# Altium schematic sheet PWMSoldeerbout.SchDoc
size A4; SheetNumber: 5; SheetTotal: 5
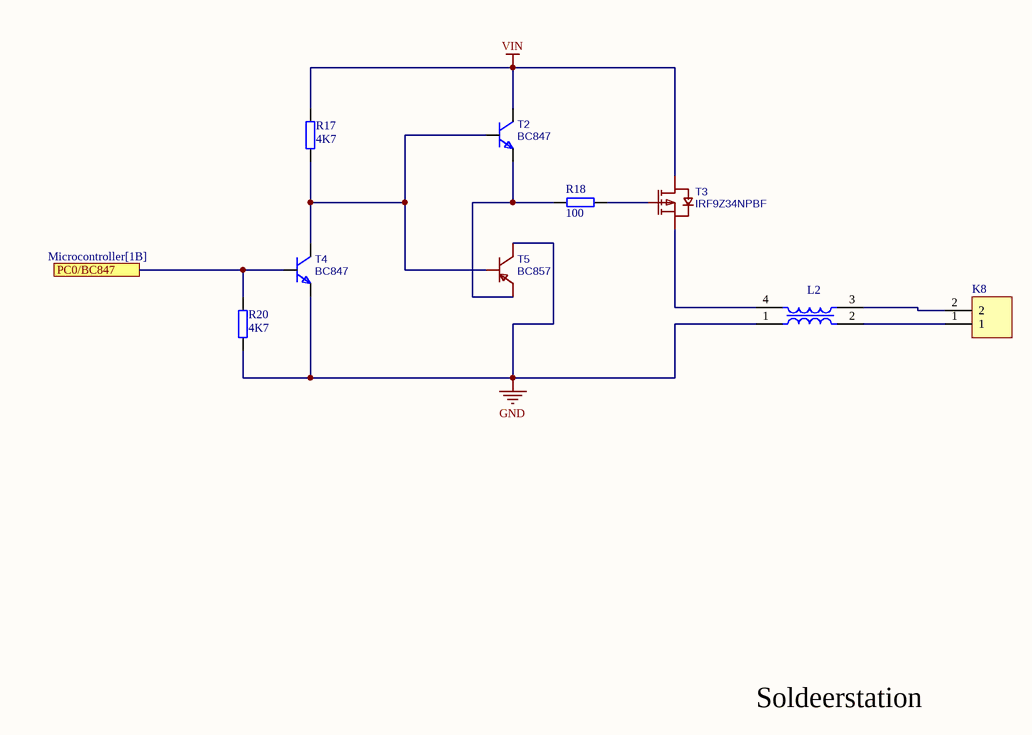
[diagram p0: PWMSoldeerbout.SchDoc]

## Parts
K8  (no value)  [Terminal_2]
L2  (no value)  [L1 Smoorspoel]
R17  4K7  [RESC2013X50X30ML20T20]
R18  100  [RESC2013X50X30ML20T20]
R20  4K7  [RESC2013X50X30ML20T20]
T2  BC847  [T1,2,4 Bipolar Transistors]
T3  IRF9Z34NPBF  [T3 MOSFET-P]
T4  BC847  [T1,2,4 Bipolar Transistors]
T5  BC857  [T5 Bipolar Transistors]

## Ports
PC0/BC847 (see Microcontroller[1B])

## Nets
GND: L2.1 R20.1 T4.2(E) T5.3
VIN: R17.2 T2.3(C) T3.2(D)
PC0/BC847: R20.2 T4.1(B) ; port PC0/BC847
NetK8_1: K8.1 L2.2
NetK8_2: K8.2 L2.3
NetL2_4: L2.4 T3.3(S)
NetR17_1: R17.1 T2.1(B) T4.3(C) T5.1
NetR18_1: R18.1 T3.1(G)
NetR18_2: R18.2 T2.2(E) T5.2

## Notes on the sheet
- Soldeerstation

## Library data of the parts
K8 = K Terminal_2
L2 = L2 Common Mode Choke: Common Mode Chokes / Filters 170ohms 100MHz 10A 1 Choke SMD; Manufacturer_Name: Laird Performance Materials; Manufacturer_Part_Number: CM2545X171R-10; Geometry.Height: 9.5mm; Mouser Part Number: 875-CM2545X171R-10; Mouser Price/Stock: https://www.mouser.co.uk/ProductDetail/Laird-Performance-Materials/CM2545X171R-10?qs=gHrF1kHvtHWa9UjYzLX7bQ%3D%3D; Datasheet Link: https://componentsearchengine.com/Datasheets/1/CM2545X171R-10.pdf
R17 R18 R20 = R Resistor: Manufacturer: Vishay Dale; Part Number: CRCW08050000Z0EA
T2 T4 = T1,2,4 transisitors: BC847C_C3027113; BOM_Manufacturer: SALLTECH(萨瑞); BOM_Manufacturer Part: BC847C; Contributor: lcsc; BOM_Supplier: LCSC; BOM_Supplier Part: C3027113; link: https://atta.szlcsc.com/upload/public/pdf/source/20220824/287706FC7904CA05889B348536529CCD.pdf; BOM_JLCPCB Part Class: Extended Part; spicePre: Q; spiceSymbolName: BC847C_C3027113
T3 = T3 MOSFET-P: BOM_Manufacturer: Infineon(英飞凌); Contributor: LCSC; BOM_Supplier: LCSC; BOM_Supplier Part: C500523; BOM_Manufacturer Part: IRF9Z34NPBF; BOM_JLCPCB Part Class: Extended Part; spicePre: Q; spiceSymbolName: IRF9Z34NPBF
T5 = T5 Bipolar Transistor: BC857 3G; BOM_Manufacturer: CJ(江苏长电/长晶); BOM_Supplier: LCSC; BOM_Manufacturer Part: BC857; BOM_Supplier Part: C2139; BOM_JLCPCB Part Class: Extended Part; spicePre: Q; spiceSymbolName: BC857 3G